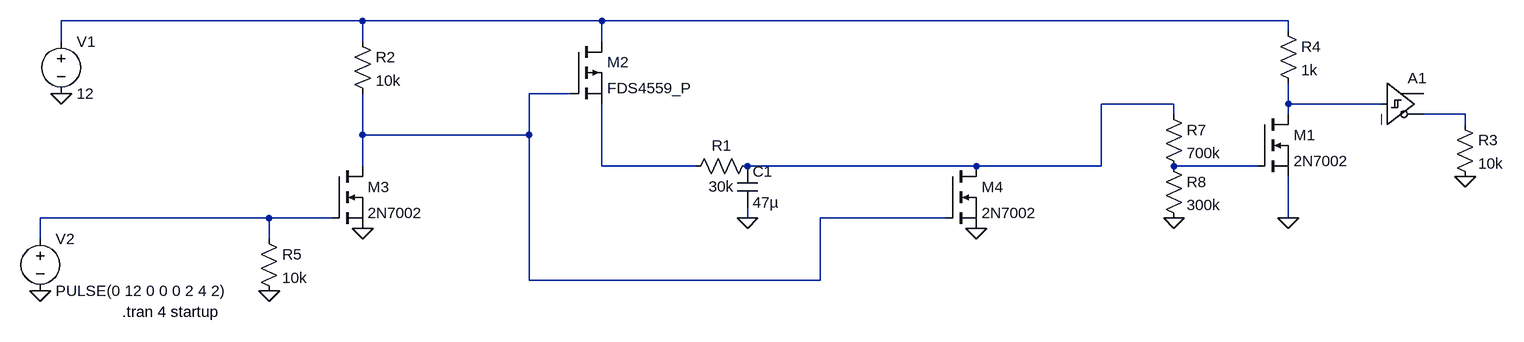
[diagram p0: schematic Draft1.asc]
Draft1.asc, the LTspice schematic file:
Version 4
SHEET 1 1296 680
WIRE -464 -80 -928 -80
WIRE -96 -80 -464 -80
WIRE 960 -80 -96 -80
WIRE 960 -64 960 -80
WIRE -928 -48 -928 -80
WIRE -464 -48 -464 -80
WIRE -96 -48 -96 -80
WIRE -144 32 -208 32
WIRE 784 48 672 48
WIRE 960 48 960 16
WIRE 1104 48 960 48
WIRE 784 64 784 48
WIRE 960 64 960 48
WIRE 1232 64 1168 64
WIRE 1232 80 1232 64
WIRE -464 96 -464 32
WIRE -208 96 -208 32
WIRE -208 96 -464 96
WIRE -464 144 -464 96
WIRE -96 144 -96 48
WIRE 48 144 -96 144
WIRE 480 144 128 144
WIRE 672 144 672 48
WIRE 672 144 480 144
WIRE 912 144 784 144
WIRE -608 224 -960 224
WIRE -512 224 -608 224
WIRE 128 224 128 208
WIRE 432 224 240 224
WIRE 960 224 960 160
WIRE -960 256 -960 224
WIRE -608 256 -608 224
WIRE -208 320 -208 96
WIRE 240 320 240 224
WIRE 240 320 -208 320
FLAG 128 224 0
FLAG 480 240 0
FLAG 1232 160 0
FLAG 960 224 0
FLAG -928 32 0
FLAG -960 336 0
FLAG -464 240 0
FLAG -608 336 0
FLAG 784 224 0
SYMBOL cap 112 144 R0
SYMATTR InstName C1
SYMATTR Value 47µ
SYMBOL res 144 128 R90
WINDOW 0 0 56 VBottom 2
WINDOW 3 32 56 VTop 2
SYMATTR InstName R1
SYMATTR Value 30k
SYMBOL Digital\\schmitt 1104 -16 R0
SYMATTR InstName A1
SYMBOL res 1216 64 R0
SYMATTR InstName R3
SYMATTR Value 10k
SYMBOL nmos 912 64 R0
SYMATTR InstName M1
SYMATTR Value 2N7002
SYMBOL res 944 -80 R0
SYMATTR InstName R4
SYMATTR Value 1k
SYMBOL pmos -144 -48 R0
SYMATTR InstName M2
SYMATTR Value FDS4559_P
SYMBOL nmos -512 144 R0
SYMATTR InstName M3
SYMATTR Value 2N7002
SYMBOL nmos 432 144 R0
SYMATTR InstName M4
SYMATTR Value 2N7002
SYMBOL voltage -928 -64 R0
WINDOW 123 0 0 Left 0
WINDOW 39 0 0 Left 0
SYMATTR InstName V1
SYMATTR Value 12
SYMBOL voltage -960 240 R0
WINDOW 123 0 0 Left 0
WINDOW 39 0 0 Left 0
SYMATTR InstName V2
SYMATTR Value PULSE(0 12 0 0 0 2 4 2)
SYMBOL res -480 -64 R0
SYMATTR InstName R2
SYMATTR Value 10k
SYMBOL res -624 240 R0
SYMATTR InstName R5
SYMATTR Value 10k
SYMBOL res 768 48 R0
SYMATTR InstName R7
SYMATTR Value 700k
SYMBOL res 768 128 R0
SYMATTR InstName R8
SYMATTR Value 300k
TEXT -834 368 Left 2 !.tran 4 startup

The netlist it stands for:
* Draft1.asc
C1 N003 0 47µ
R1 N003 N006 30k
A1 N004 0 0 0 0 N005 0 0 SCHMITT
R3 N005 0 10k
M1 N004 N007 0 0 2N7002
R4 N001 N004 1k
M2 N001 N002 N006 N006 FDS4559_P
M3 N002 N008 0 0 2N7002
M4 N003 N002 0 0 2N7002
V1 N001 0 12
V2 N008 0 PULSE(0 12 0 0 0 2 4 2)
R2 N001 N002 10k
R5 N008 0 10k
R7 N003 N007 700k
R8 N007 0 300k
.model NMOS NMOS
.model PMOS PMOS
.lib standard.mos
.tran 4 startup
.backanno
.end